# Altium project MAX30208_HSP3_DEMO_B.PrjPcb
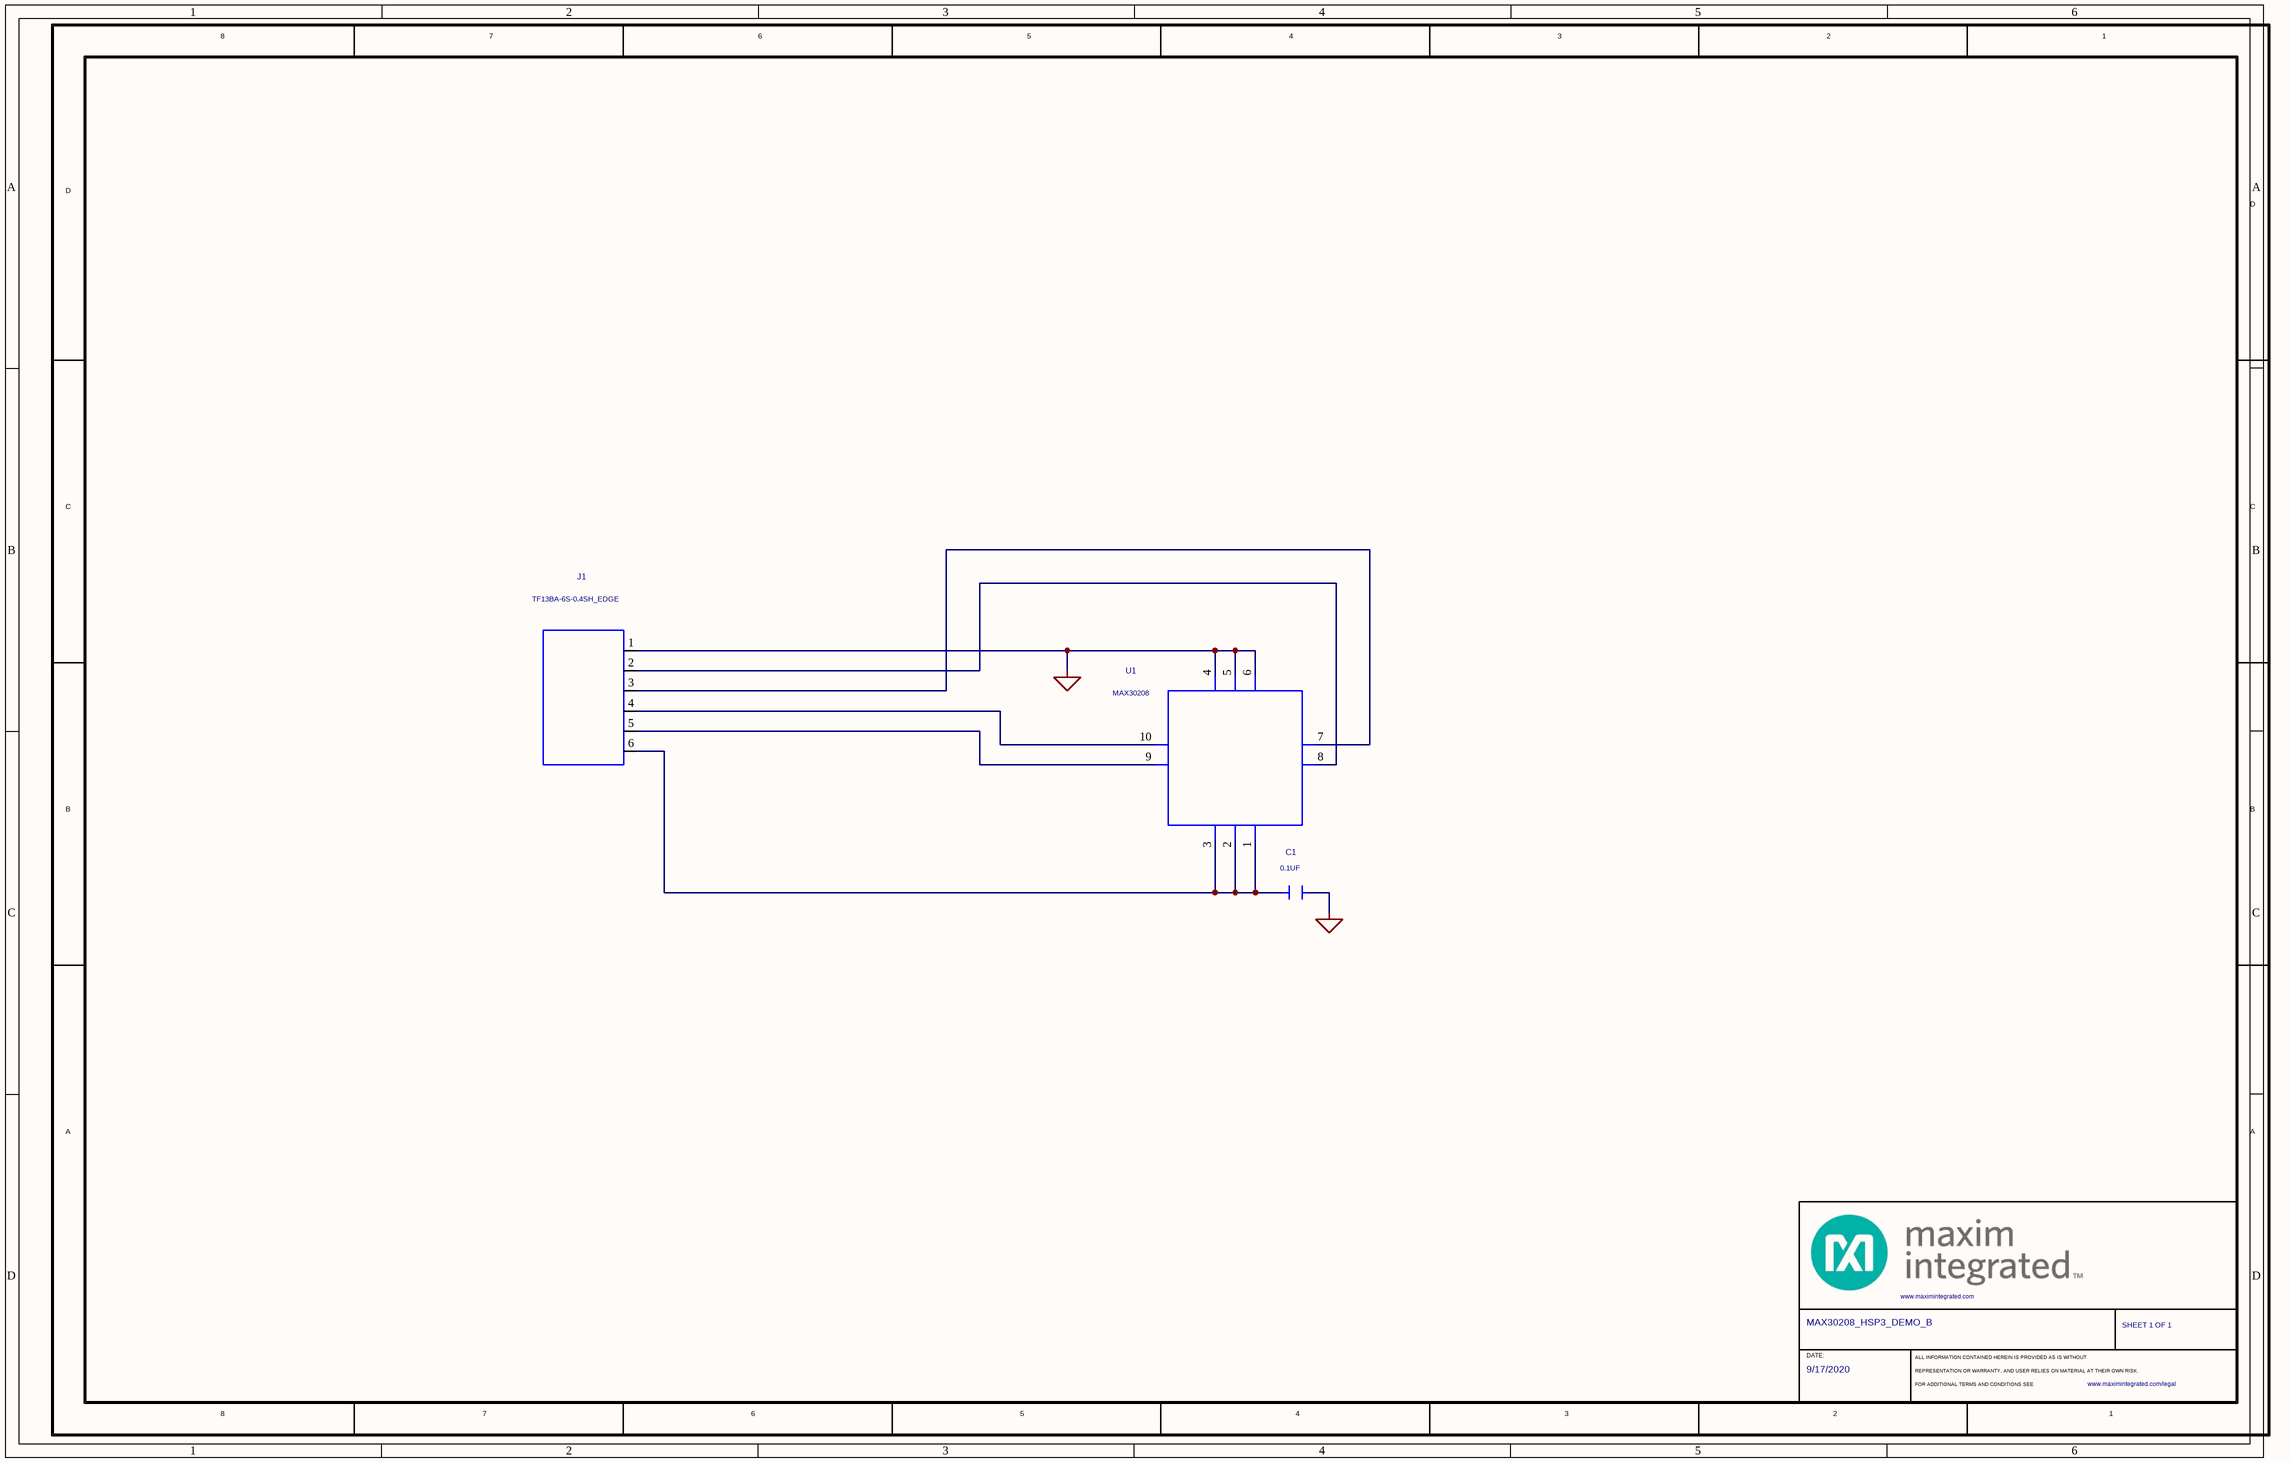
[diagram p0: MAX30208_HSP3_DEMO_B.SchDoc]
1 sheet, 4 parts. Net scope: global (net labels, ports and power ports of the same name join across sheets).

## Sheet MAX30208_HSP3_DEMO_B.SchDoc
size 426 x 274 mm

### Parts
*  CUSTOM_TXT_CDS21: SHEET 1 OF 1  PROJECT_TITLE: MAX30208_HSP3_DEMO_B  DATE: 9/17/2020  (hidden comment: MAXIM_B_SIZE_CF)  (graphical)
C1  0.1UF  [CAPC0603X33M]
J1  TF13BA-6S-0.4SH_EDGE  [HRSC_TF13BA-6S-0_4SH_EDGE]
U1  MAX30208  [MAX_90-100101_1-10]

### Nets
GND_SIGNAL: C1.2 J1.1 U1.4 U1.5 U1.6
NetC1_1: C1.1 J1.6 U1.1 U1.2 U1.3
NetJ1_2: J1.2 U1.8
NetJ1_3: J1.3 U1.7
NetJ1_4: J1.4 U1.10
NetJ1_5: J1.5 U1.9

### Notes on the sheet
- (in symbol MAXIM_B_SIZE_CF) 8; 7; 6; 5; 4; 3; 2; D; C; B; A; DATE:; ALL INFORMATION CONTAINED HEREIN IS PROVIDED AS IS WITHOUT; REPRESENTATION OR WARRANTY, AND USER RELIES ON MATERIAL AT THEIR OWN RISK.; FOR ADDITIONAL TERMS AND CONDITIONS SEE

### Library data of the parts
* = MAXIM_B_SIZE_CF: OriginalSymbolOrigin: (175,5230); COMMENT_BODY: TRUE; Page Number: 1; CURRENT_DESIGN_SHEET: Page_1; LEAGAL_WEBLINK: www.maximintegrated.com/legal; WEBLINK1: www.maximintegrated.com
C1 = CAP_NP: CAP; SMT (0201); 0.1UF; 10%; 25V; X6S; CERAMIC; MFG_PART_NUMBER: GRM033C81E104KE14; MANUFACTURER: MURATA; OriginalSymbolOrigin: (-50,50); PACK_TYPE: 0201CAPM; MAXINV: 20-000U1-DA39; CAP: 1.00E-07; DRAWING: @MAX30208_HSP3_DEMO_B_LIB.MAX30208_HSP3_DEMO_B(SCH_1):PAGE1; PHYS_PAGE: 1; TEMP_RANGE: -55 DEGC TO +105 DEGC; VLOG_PARAM01: CAP:INTEGER; MATERIAL_TYPE: CERAMIC CHIP; CASE: SMT (0201); REFLOW: -; TOLERANCE: 10%; VER: 1; VOLTAGE_RATING: 25V
J1 = TF13BA-6S: CONNECTOR; MALE; SMT; TF13BA SERIES; FPC/FFC CONNECTOR; 6PINS; NOTE: EDGE CONNECTOR TO BE USED AT THE END OF A FLEX BOARD; MANUFACTURER: HIROSE ELECTRIC CO LTD; OriginalSymbolOrigin: (-150,275); PACK_TYPE: SMD_EDGE; DRAWING: @MAX30208_HSP3_DEMO_B_LIB.MAX30208_HSP3_DEMO_B(SCH_1):PAGE1; PHYS_PAGE: 1; MAXINV: N/A; MFG_PART_NUMBER: TF13BA-6S-0.4SH_EDGE; REFLOW: -; TOLERANCE: N/A; VER: 1; VOLTAGE_RATING: N/A; TEMP_RANGE: N/A
U1 = EK_MAX30208: EVKIT PART - IC; MAX30208; PACKAGE OUTLINE DRAWING: 21-100265; LGA10; MANUFACTURER: MAXIM; OriginalSymbolOrigin: (-325,300); DRAWING: @MAX30208_HSP3_DEMO_B_LIB.MAX30208_HSP3_DEMO_B(SCH_1):PAGE1; PHYS_PAGE: 1; PACK_TYPE: LGA10; MAXINV: N/A; MFG_PART_NUMBER: MAX30208; REFLOW: -; SEC_TYPE: LGA10; TOLERANCE: N/A; VER: 1; VOLTAGE_RATING: N/A; TEMP_RANGE: N/A